# Altium schematic sheet stepper_driver.SchDoc
size 431 x 279 mm; Author: Shivam Sharma; SheetNumber: 13; SheetTotal: 14
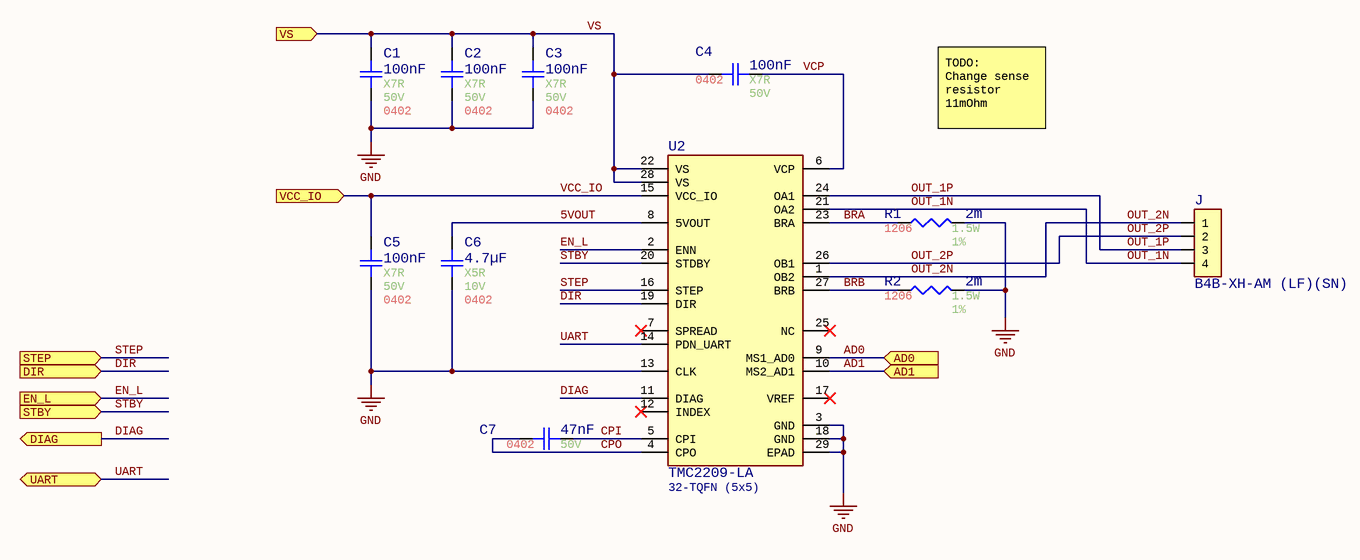
[diagram p0: stepper_driver.SchDoc]

## Parts
C1  value 100nF  Temperature Coefficient: X7R  Voltage Rating: 50V  Case/Package: 0402  [Generic 0402 capacitor]  (hidden comment: GRT155R71H104KE01D)
C2  value 100nF  Temperature Coefficient: X7R  Voltage Rating: 50V  Case/Package: 0402  [Generic 0402 capacitor]  (hidden comment: GRT155R71H104KE01D)
C3  value 100nF  Temperature Coefficient: X7R  Voltage Rating: 50V  Case/Package: 0402  [Generic 0402 capacitor]  (hidden comment: GRT155R71H104KE01D)
C4  value 100nF  Temperature Coefficient: X7R  Voltage Rating: 50V  Case/Package: 0402  [Generic 0402 capacitor]  (hidden comment: GRT155R71H104KE01D)
C5  value 100nF  Temperature Coefficient: X7R  Voltage Rating: 50V  Case/Package: 0402  [Generic 0402 capacitor]  (hidden comment: GRT155R71H104KE01D)
C6  value 4.7µF  Temperature Coefficient: X5R  Voltage Rating: 10V  Case/Package: 0402  [Generic 0402 capacitor]  (hidden comment: GRT155R61A475ME13D)
C7  value 47nF  Voltage Rating: 50V  Case/Package: 0402  [Generic 0402 capacitor]  (hidden comment: GRM155R71H473KE14D)
J  B4B-XH-AM (LF)(SN)  [FP-B4B-XH-AM_LF_SN-MFG]
R1  value 2m  Power: 1.5W  Tolerance: 1%  Case/Package: 1206  [Generic 1206 resistor]  (hidden comment: PA1206FRM670R002L)
R2  value 2m  Power: 1.5W  Tolerance: 1%  Case/Package: 1206  [Generic 1206 resistor]  (hidden comment: PA1206FRM670R002L)
U2  TMC2209-LA  Case/Package: 32-TQFN (5x5)  [QFN-28_5x5x0.9mm_P0.5mm]

## Ports
AD0 (in), AD1 (in), DIAG (out), DIR (in), EN_L (in), STBY (in), STEP (in), UART (bidir), VCC_IO (in), VS (in)

## Nets
GND: C1.1 C2.1 C3.1 C5.1 C6.1 R1.2 R2.2 U2.3(GND) U2.13(CLK) U2.18(GND) U2.29(EPAD)
5VOUT: C6.2 U2.8(5VOUT)
AD0: U2.9(MS1_AD0) ; port AD0
AD1: U2.10(MS2_AD1) ; port AD1
BRA: R1.1 U2.23(BRA)
BRB: R2.1 U2.27(BRB)
CPI: C7.1 U2.5(CPI)
CPO: C7.2 U2.4(CPO)
DIAG: U2.11(DIAG) ; port DIAG
DIR: U2.19(DIR) ; port DIR
EN_L: U2.2(ENN) ; port EN_L
OUT_1N: J.4 U2.21(OA2)
OUT_1P: J.3 U2.24(OA1)
OUT_2N: J.1 U2.1(OB2)
OUT_2P: J.2 U2.26(OB1)
STBY: U2.20(STDBY) ; port STBY
STEP: U2.16(STEP) ; port STEP
UART: U2.14(PDN_UART) ; port UART
VCC_IO: C5.2 U2.15(VCC_IO) ; port VCC_IO
VCP: C4.1 U2.6(VCP)
VS: C1.2 C2.2 C3.2 C4.2 U2.22(VS) U2.28(VS) ; port VS

Not connected (* = marked no-connect by the designer): U2 7(SPREAD)* 12(INDEX)* 17(VREF)* 25(NC)*

## Notes on the sheet
- TODO:
  Change sense resistor 11mOhm
- Title:
- Author:
- Approved:
- Size:
- Date:
- Git Hash:
- Sch Revision:
- B
- Prj:
- SCH PN:
- Variant:
- Edited:
- CONFIDENTIAL
- File:

## Library data of the parts
C1-C5 = CMP-001-00084-12: Ceramic Capacitor, Multilayer, Ceramic, 50V, 10% +Tol, 10% -Tol, X7R, 15% TC, 0.1uF, Surface Mount, 0402; Multilayer: Yes; Terminal Finish: Nickel; Capacitor Type: Ceramic; Package Shape: Rectangular; Reach SVHC Compliant: Yes; Max Operating Temperature: 125°C; RoHS Compliant: Yes; Termination: Wraparound; Packaging: Tape and Reel; AECQ: Yes; Pins: 2; Dielectric Material: Ceramic; Min Operating Temperature: -55°C; Tolerance: 10%; Mounting Technology: Surface Mount
C6 = CMP-001-00085-5: Ceramic Capacitor, Multilayer, Ceramic, 10V, 20% +Tol, 20% -Tol, X5R, 15% TC, 4.7uF, Surface Mount, 0402; Multilayer: Yes; Tolerance: 0%; Reach SVHC Compliant: Yes; Tolerance (fill in as +-): 20%; Packaging: Tape and Reel; Dielectric Material: Ceramic; Mounting Technology: Surface Mount; RoHS Compliant: Yes; Tolerance  (fill in as +-): 20%; Rated DC Voltage (URdc): 10V; Package Shape: Rectangular; Termination: Wraparound; Pins: 2; Max Operating Temperature: 85°C; Capacitor Type: Ceramic; Min Operating Temperature: -55°C; AECQ: Yes
C7 = CMP-001-00113-1: 50V 47nF X7R ±10% 0402 Multilayer Ceramic Capacitors MLCC - SMD/SMT ROHS; AECQ: No; Mounting Technology: SMD; Tolerance: 10%; Pins: 2; Min Operating Temperature: -55°C; Max Operating Temperature: 125°C; Capacitor Type: Ceramic
J = CMP-002-00133-1: Header, Xh, Top, 4Way, 2.5Mm, Boss;; Manufacturer: JST; Max Current Rating: 3A; Gender: Male; Pitch: 2.4892mm; Voltage Rating: 250V; Length: 12.4mm; Min Operating Temperature: -25°C; Max Operating Temperature: 85°C; Pins: 4; Manufacturer Series: XH; Case/Package: THT; Height: 7mm; Connector Type: Header
R1 R2 = CMP-009-00231-1: Res 0.002 Ohm 1% 1.5W 1206; Manufacturer Part Number: Blank; AECQ: Yes; Max Operating Temperature: 170°C; Min Operating Temperature: -55°C; Pins: 2; Mounting Technology: SMD
U2 = CMP-031-00019-2: Step/Direction StealthChop Stepper Motor Driver Two-Phase 4.75V to 29V 28-Pin QFN Tray; MPN: TMC5240ATJ+T; Min Supply Voltage: 1.5V; AECQ: No; Max Supply Voltage: 29V; Min Operating Temperature: -40°C; Pins: 32; Max Operating Temperature: 125°C; Mounting Technology: SMD